# Altium schematic sheet Dischargers.SchDoc
size A4; SheetNumber: 6; SheetTotal: 6
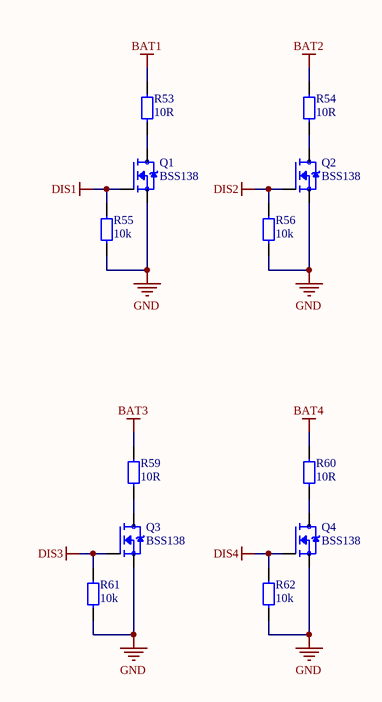
[diagram p0: Dischargers.SchDoc]

## Parts
Q1  BSS138  [TRANS_SS8050-G]
Q2  BSS138  [TRANS_SS8050-G]
Q3  BSS138  [TRANS_SS8050-G]
Q4  BSS138  [TRANS_SS8050-G]
R53  10R  [THT 3W resistor]
R54  10R  [THT 3W resistor]
R55  value 10k  [0603 Resistor]  (hidden comment: Resistor 10k 0603)
R56  value 10k  [0603 Resistor]  (hidden comment: Resistor 10k 0603)
R59  10R  [THT 3W resistor]
R60  10R  [THT 3W resistor]
R61  value 10k  [0603 Resistor]  (hidden comment: Resistor 10k 0603)
R62  value 10k  [0603 Resistor]  (hidden comment: Resistor 10k 0603)

## Nets
BAT1: R53.2(CW)
BAT2: R54.2(CW)
BAT3: R59.2(CW)
BAT4: R60.2(CW)
DIS1: Q1.1(G) R55.1(CCW)
DIS2: Q2.1(G) R56.1(CCW)
DIS3: Q3.1(G) R61.1(CCW)
DIS4: Q4.1(G) R62.1(CCW)
GND: Q1.2(S) Q2.2(S) Q3.2(S) Q4.2(S) R55.2(CW) R56.2(CW) R61.2(CW) R62.2(CW)
NetQ1_3: Q1.3(D) R53.1(CCW)
NetQ2_3: Q2.3(D) R54.1(CCW)
NetQ3_3: Q3.3(D) R59.1(CCW)
NetQ4_3: Q4.3(D) R60.1(CCW)

## Library data of the parts
Q1-Q4 = BSS138: N-Channel 50 V 220mA (Ta) 350mW (Ta) Surface Mount SOT-23-3; MF: onsemi; SnapEDA_Link: https://www.snapeda.com/parts/BSS138/Onsemi/view-part/?ref=snap; Package: SOT-23-3 Motorola; Value: *; MP: BSS138; Check_prices: https://www.snapeda.com/parts/BSS138/Onsemi/view-part/?ref=eda
R53 R54 R59 R60 = 15R 3W THT
R55 R56 R61 R62 = CMP-009-00225-1: 10k 0603; Source: 0603.SchLib; Component Type: Standard; Design Item ID: Resistor 10k 0603; Pins: 2